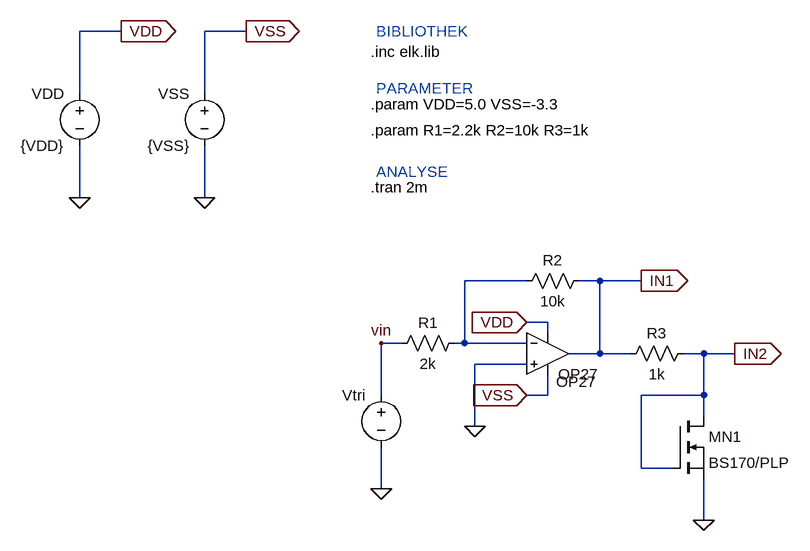
[diagram p0: schematic Activity_23_NMOS.asc]
Activity_23_NMOS.asc, the LTspice schematic file:
Version 4
SHEET 1 1408 680
WIRE -1504 -304 -1568 -304
WIRE -1312 -304 -1376 -304
WIRE -1568 -208 -1568 -304
WIRE -1376 -208 -1376 -304
WIRE -1568 -48 -1568 -128
WIRE -1376 -48 -1376 -128
WIRE -880 80 -976 80
WIRE -768 80 -800 80
WIRE -704 80 -768 80
WIRE -848 144 -880 144
WIRE -848 160 -848 144
WIRE -1072 176 -1104 176
WIRE -976 176 -976 80
WIRE -976 176 -992 176
WIRE -880 176 -976 176
WIRE -768 192 -768 80
WIRE -768 192 -816 192
WIRE -720 192 -768 192
WIRE -608 192 -640 192
WIRE -560 192 -608 192
WIRE -880 208 -960 208
WIRE -1104 256 -1104 176
WIRE -848 256 -848 224
WIRE -848 256 -880 256
WIRE -608 256 -608 192
WIRE -608 256 -704 256
WIRE -608 288 -608 256
WIRE -960 304 -960 208
WIRE -704 368 -704 256
WIRE -656 368 -704 368
WIRE -1104 400 -1104 336
WIRE -608 448 -608 384
FLAG -880 144 VDD
IOPIN -880 144 In
FLAG -880 256 VSS
IOPIN -880 256 In
FLAG -608 448 0
FLAG -960 304 0
FLAG -1568 -48 0
FLAG -1504 -304 VDD
IOPIN -1504 -304 Out
FLAG -1376 -48 0
FLAG -1312 -304 VSS
IOPIN -1312 -304 Out
FLAG -560 192 IN2
IOPIN -560 192 Out
FLAG -704 80 IN1
IOPIN -704 80 Out
FLAG -1104 400 0
FLAG -1104 176 vin
SYMBOL Opamps\\UniversalOpamp2 -848 192 R0
WINDOW 0 13 43 Left 2
SYMATTR InstName OP27
SYMATTR SpiceModel ""
SYMATTR Value2 ""
SYMATTR SpiceLine ""
SYMATTR SpiceLine2 ""
SYMATTR Value OP27
SYMBOL res -976 160 R90
WINDOW 0 0 56 VBottom 2
WINDOW 3 32 56 VTop 2
SYMATTR InstName R1
SYMATTR Value 2k
SYMBOL res -784 64 R90
WINDOW 0 0 56 VBottom 2
WINDOW 3 32 56 VTop 2
SYMATTR InstName R2
SYMATTR Value 10k
SYMBOL res -624 176 R90
WINDOW 0 0 56 VBottom 2
WINDOW 3 32 56 VTop 2
SYMATTR InstName R3
SYMATTR Value 1k
SYMBOL voltage -1568 -224 M0
WINDOW 123 24 124 Left 2
WINDOW 39 0 0 Left 2
SYMATTR InstName VDD
SYMATTR Value {VDD}
SYMBOL voltage -1376 -224 M0
WINDOW 123 24 124 Left 2
WINDOW 39 0 0 Left 2
SYMATTR InstName VSS
SYMATTR Value {VSS}
SYMBOL voltage -1104 240 M0
WINDOW 123 0 0 Left 0
WINDOW 39 0 0 Left 0
WINDOW 3 24 96 Invisible 2
SYMATTR Value PULSE(-0.9 0 0 0.5m 0.5m 1e-10 1m 4)
SYMATTR InstName Vtri
SYMBOL nmos -656 288 R0
SYMATTR InstName MN1
SYMATTR Value BS170/PLP
SYMATTR Prefix X
TEXT -1120 -272 Left 2 !.inc elk.lib
TEXT -1120 -192 Left 2 !.param VDD=5.0 VSS=-3.3
TEXT -1120 -64 Left 2 !.tran 2m
TEXT -1120 -152 Left 2 !.param R1=2.2k R2=10k R3=1k
TEXT -1112 -304 Left 2 ;BIBLIOTHEK
TEXT -1112 -216 Left 2 ;PARAMETER
TEXT -1112 -88 Left 2 ;ANALYSE

The netlist it stands for:
* Activity_23_NMOS.asc
XOP27 0 N001 VDD VSS IN1 OP27  ; pins IN+ IN- V+ V- OUT
R1 N001 vin 2k
R2 IN1 N001 10k
R3 IN2 IN1 1k
VDD VDD 0 {VDD}
VSS VSS 0 {VSS}
Vtri vin 0 PULSE(-0.9 0 0 0.5m 0.5m 1e-10 1m 4)
XMN1 IN2 IN2 0 BS170/PLP  ; pins D G S
.inc elk.lib
.param VDD=5.0 VSS=-3.3
.tran 2m
.param R1=2.2k R2=10k R3=1k
* BIBLIOTHEK
* PARAMETER
* ANALYSE
.lib UniversalOpamps2.sub
.backanno
.end